# EAGLE design 7segement4digits1badidea-shield-mk-4 (EAGLE 6.5.0)
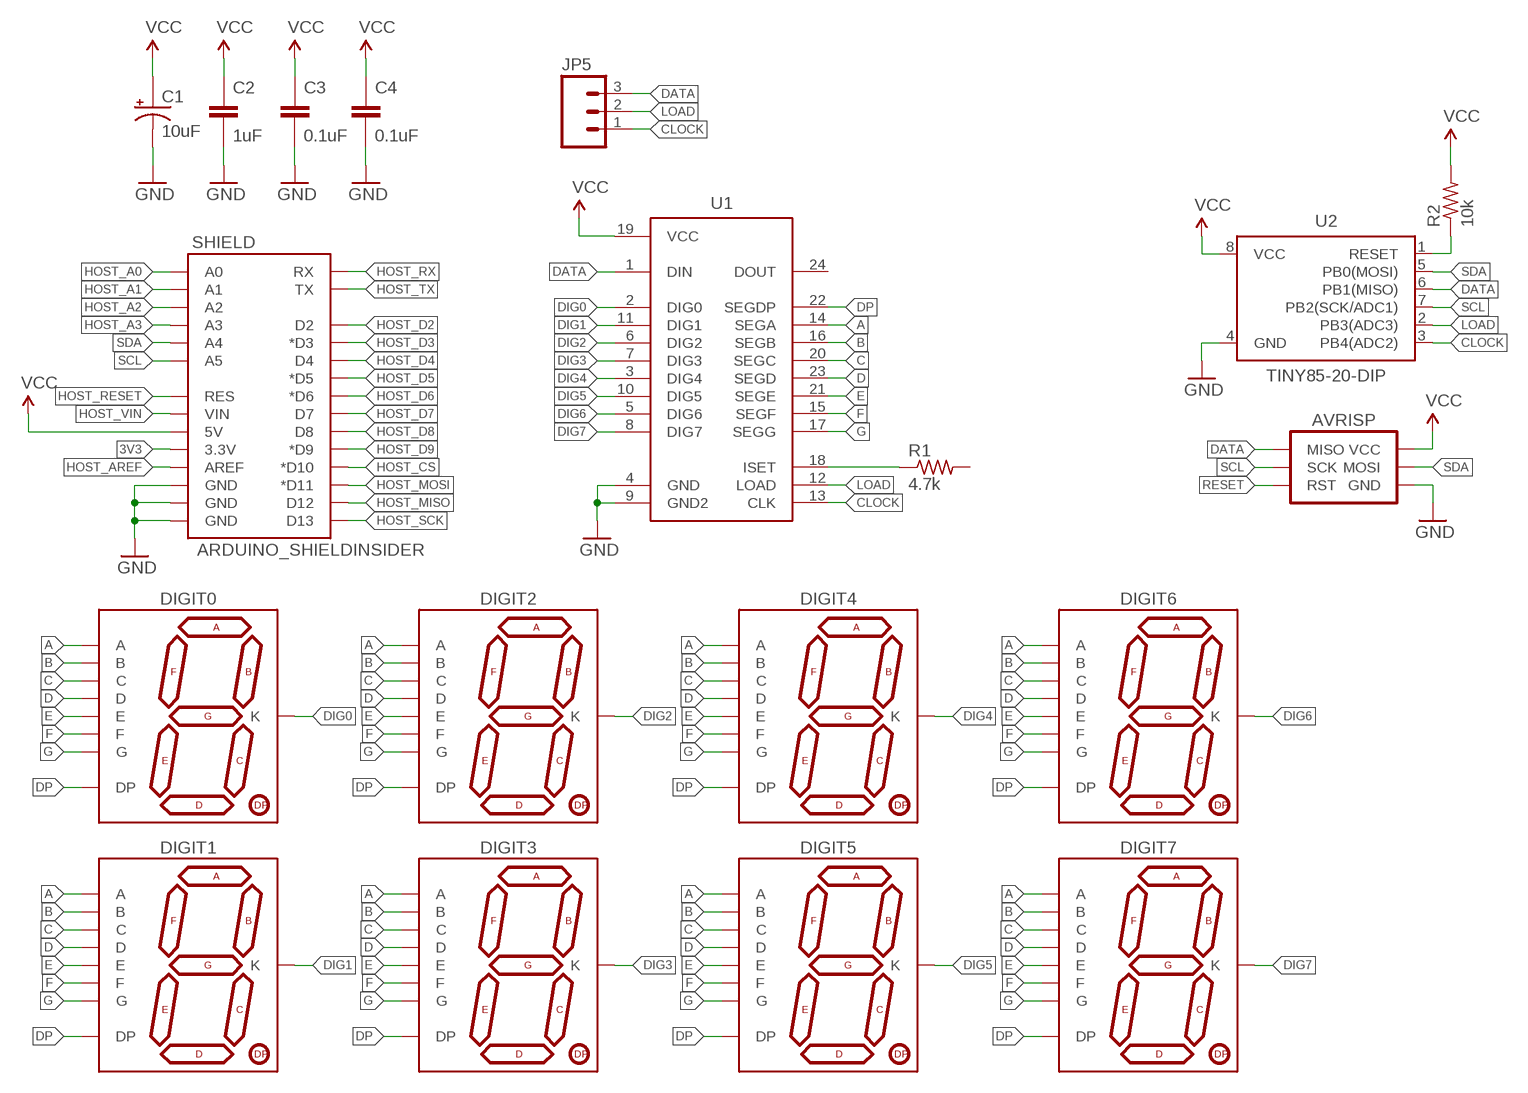
[diagram p0: schematic, sheet 1]

## Parts
AVRISP  AVR_SPI_PRG_6PTH  [2X3]
C1  10uF  CAPACITOR-POLARIZEDE2.5-5  [E2,5-5]
C2  1uF  CAPACITOR-CERAMIC025-024X044  [C025-024X044]
C3  0.1uF  CAPACITOR-CERAMIC025-024X044  [C025-024X044]
C4  0.1uF  CAPACITOR-CERAMIC025-024X044  [C025-024X044]
DIGIT0  7SEG_1DIGPTH-10MM  [7SEG_1DIG_10MM]
DIGIT1  7SEG_1DIGPTH-10MM  [7SEG_1DIG_10MM]
DIGIT2  7SEG_1DIGPTH-10MM  [7SEG_1DIG_10MM]
DIGIT3  7SEG_1DIGPTH-10MM  [7SEG_1DIG_10MM]
DIGIT4  7SEG_1DIGPTH-10MM  [7SEG_1DIG_10MM]
DIGIT5  7SEG_1DIGPTH-10MM  [7SEG_1DIG_10MM]
DIGIT6  7SEG_1DIGPTH-10MM  [7SEG_1DIG_10MM]
DIGIT7  7SEG_1DIGPTH-10MM  [7SEG_1DIG_10MM]
JP5  M03PTH  [1X03]
R1  4.7k  RESISTORPTH-AXIAL-7.68MM  [RESISTOR-AXIAL-PTH-7.68MM]
R2  10k  RESISTORPTH-AXIAL-7.68MM  [RESISTOR-AXIAL-PTH-7.68MM]
SHIELD  ARDUINO_SHIELDINSIDER  [ARDUINO_SHIELD_NOOUTLINE_INSIDE]
U1  MAX7219DIP  [DIL24]
U2  TINY85-20-DIP  ATTINY45TINY85-20-DIP  [DIP08]

## Nets
3V3: SHIELD.3.3V
A: DIGIT0.10(A) DIGIT1.10(A) DIGIT2.10(A) DIGIT3.10(A) DIGIT4.10(A) DIGIT5.10(A) DIGIT6.10(A) DIGIT7.10(A) U1.14(SEGA)
B: DIGIT0.9(B) DIGIT1.9(B) DIGIT2.9(B) DIGIT3.9(B) DIGIT4.9(B) DIGIT5.9(B) DIGIT6.9(B) DIGIT7.9(B) U1.16(SEGB)
C: DIGIT0.8(C) DIGIT1.8(C) DIGIT2.8(C) DIGIT3.8(C) DIGIT4.8(C) DIGIT5.8(C) DIGIT6.8(C) DIGIT7.8(C) U1.20(SEGC)
CLOCK: JP5.1 U1.13(CLK) U2.3(PB4(ADC2))
D: DIGIT0.5(D) DIGIT1.5(D) DIGIT2.5(D) DIGIT3.5(D) DIGIT4.5(D) DIGIT5.5(D) DIGIT6.5(D) DIGIT7.5(D) U1.23(SEGD)
DATA: AVRISP.1(MISO) JP5.3 U1.1(DIN) U2.6(PB1(MISO))
DIG0: DIGIT0.1(K) DIGIT0.6(K) U1.2(DIG0)
DIG1: DIGIT1.1(K) DIGIT1.6(K) U1.11(DIG1)
DIG2: DIGIT2.1(K) DIGIT2.6(K) U1.6(DIG2)
DIG3: DIGIT3.1(K) DIGIT3.6(K) U1.7(DIG3)
DIG4: DIGIT4.1(K) DIGIT4.6(K) U1.3(DIG4)
DIG5: DIGIT5.1(K) DIGIT5.6(K) U1.10(DIG5)
DIG6: DIGIT6.1(K) DIGIT6.6(K) U1.5(DIG6)
DIG7: DIGIT7.1(K) DIGIT7.6(K) U1.8(DIG7)
DP: DIGIT0.7(DP) DIGIT1.7(DP) DIGIT2.7(DP) DIGIT3.7(DP) DIGIT4.7(DP) DIGIT5.7(DP) DIGIT6.7(DP) DIGIT7.7(DP) U1.22(SEGDP)
E: DIGIT0.4(E) DIGIT1.4(E) DIGIT2.4(E) DIGIT3.4(E) DIGIT4.4(E) DIGIT5.4(E) DIGIT6.4(E) DIGIT7.4(E) U1.21(SEGE)
F: DIGIT0.2(F) DIGIT1.2(F) DIGIT2.2(F) DIGIT3.2(F) DIGIT4.2(F) DIGIT5.2(F) DIGIT6.2(F) DIGIT7.2(F) U1.15(SEGF)
G: DIGIT0.3(G) DIGIT1.3(G) DIGIT2.3(G) DIGIT3.3(G) DIGIT4.3(G) DIGIT5.3(G) DIGIT6.3(G) DIGIT7.3(G) U1.17(SEGG)
GND: AVRISP.6(GND) C1.- C2.2 C3.2 C4.2 SHIELD.GND@0(GND) SHIELD.GND@1(GND) SHIELD.GND@2(GND) U1.4(GND) U1.9(GND2) U2.4(GND)
HOST_A0: SHIELD.A0
HOST_A1: SHIELD.A1
HOST_A2: SHIELD.A2
HOST_A3: SHIELD.A3
HOST_AREF: SHIELD.AREF
HOST_CS: SHIELD.D10(*D10)
HOST_D2: SHIELD.D2
HOST_D3: SHIELD.D3(*D3)
HOST_D4: SHIELD.D4
HOST_D5: SHIELD.D5(*D5)
HOST_D6: SHIELD.D6(*D6)
HOST_D7: SHIELD.D7
HOST_D8: SHIELD.D8
HOST_D9: SHIELD.D9(*D9)
HOST_MISO: SHIELD.D12
HOST_MOSI: SHIELD.D11(*D11)
HOST_RESET: SHIELD.RES
HOST_RX: SHIELD.RX
HOST_SCK: SHIELD.D13
HOST_TX: SHIELD.TX
HOST_VIN: SHIELD.VIN
LOAD: JP5.2 U1.12(LOAD) U2.2(PB3(ADC3))
N$1: R2.P$1 U2.1(RESET)
N$19: R1.P$1 U1.18(ISET)
RESET: AVRISP.5(RST)
SCL: AVRISP.3(SCK) SHIELD.A5 U2.7(PB2(SCK/ADC1))
SDA: AVRISP.4(MOSI) SHIELD.A4 U2.5(PB0(MOSI))
VCC: AVRISP.2(VCC) C1.+ C2.1 C3.1 C4.1 R2.P$2 SHIELD.5V U1.19(VCC) U2.8(VCC)
Unconnected: R1.P$2 U1.24(DOUT)

## Library data of the parts
AVRISP = A_butts:AVR_SPI_PRG_6: AVR ISP 6 Pin This is the reduced ISP connector for AVR programming. Common on Arduino. This footprint will take up less PCB space and can be used with a 10-pin to 6-pin adapter such as SKU: BOB-08508 **Special note about "TEST_POINT" package. The stop mask is on the top side, so if you want your programming test points to be on the bottom of your board, make sure to place this package on the bottom side of the board. This also ensure that the orientation to program from the bottom side will be correct.
C1 = A_butts:CAPACITOR-POLARIZED: POLARIZED CAPACITOR, American symbol
C2-C4 = A_butts:CAPACITOR-CERAMIC: CAPACITOR, European symbol
DIGIT0 DIGIT1-DIGIT7 = A_butts:7SEG_1DIG
JP5 = A_butts:M03: Header 3 Standard 3-pin 0.1" header. Use with straight break away headers (SKU : PRT-00116), right angle break away headers (PRT-00553), swiss pins (PRT-00743), machine pins (PRT-00117), and female headers (PRT-00115). Molex polarized connector foot print use with SKU : PRT-08232 with associated crimp pins and housings.
R1 R2 = A_butts:RESISTOR: RESISTOR, American symbol
SHIELD = A_butts:ARDUINO_SHIELD: Arduino shield footprint
U1 = A_butts:MAX7219: 8-digit, 8-segment LED display driver, serial input
U2 = A_butts:ATTINY45: Atmel 8-pin 2/4/8kB flash uC; PROD_ID: IC-09445

## Board
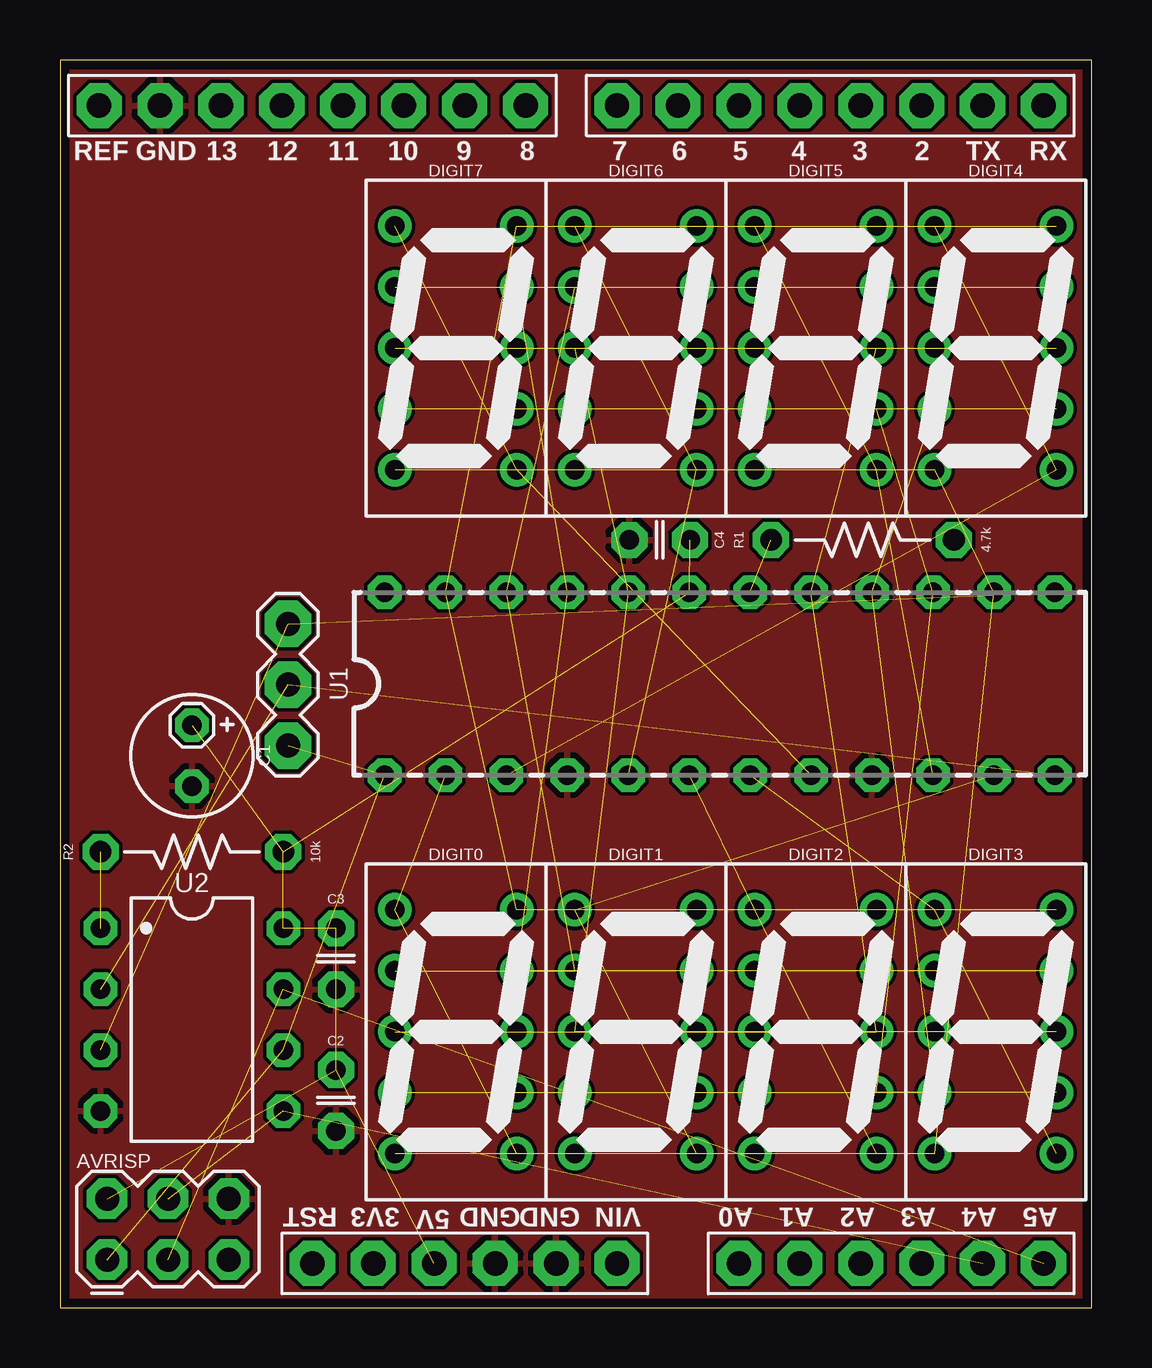
[diagram p1: board, top side]

Size 43 x 52 mm. Coordinates in mm from the lower left corner, seen from the top.
Outline: 0,52 0,0 43,0 43,52 0,52
Copper layers (1*16): Top 0.0356mm / dielectric 1.5011mm / Bottom 0.0356mm
Design rules "LaenPCBOrder_2": minimum track width 6mil, minimum drill 13mil, track to track 6mil, track to pad 6mil, pad to pad 6mil, via to via 6mil, smd to smd 6mil, copper to edge 15mil, drill to drill 6mil, minimum pad ring 7mil, minimum via ring 7mil, stop-mask expansion 3mil, vias tented up to drill 20mil, thermal gap 10mil

### Footprints (pad centres in the part's own frame; a part is rotated, then mirrored left to right if it is on the bottom)
2X3 = drill 1 pad 1.676 octagon: 1 -2.54,-1.27; 2 -2.54,1.27; 3 0,-1.27; 4 0,1.27; 5 2.54,-1.27; 6 2.54,1.27
E2,5-5 = drill 0.8 pad 1.4 octagon: + -1.27,0; - 1.27,0
C025-024X044 = drill 0.813 pad 1.5 octagon: 1 -1.27,0; 2 1.27,0
7SEG_1DIG_10MM = drill 0.8 pad 1.4: 1 -2.54,5.08; 2 -2.54,2.54; 3 -2.54,0; 4 -2.54,-2.54; 5 -2.54,-5.08; 6 2.54,-5.08; 7 2.54,-2.54; 8 2.54,0; 9 2.54,2.54; 10 2.54,5.08
1X03 = drill 1 pad 1.93 octagon: 1 0,0; 2 2.54,0; 3 5.08,0
RESISTOR-AXIAL-PTH-7.68MM = drill 0.9 pad 1.5 octagon: P$1 -3.81,0; P$2 3.81,0
ARDUINO_SHIELD_NOOUTLINE_INSIDE = drill 1.016 pad 1.88 octagon: 3.3V 48.26,-27.94; 5V 48.26,-25.4; A0 48.26,-12.7; A1 48.26,-10.16; A2 48.26,-7.62; A3 48.26,-5.08; A4 48.26,-2.54; A5 48.26,0; AREF 0,-39.37; D2 0,-5.08; D3 0,-7.62; D4 0,-10.16; D5 0,-12.7; D6 0,-15.24; D7 0,-17.78; D8 0,-21.59; D9 0,-24.13; D10 0,-26.67; D11 0,-29.21; D12 0,-31.75; D13 0,-34.29; GND@0 48.26,-22.86; GND@1 48.26,-20.32; GND@2 0,-36.83; RES 48.26,-30.48; RX 0,0; TX 0,-2.54; VIN 48.26,-17.78
DIL24 = drill 0.8 pad 1.4 octagon: 1 -13.97,-3.81; 2 -11.43,-3.81; 3 -8.89,-3.81; 4 -6.35,-3.81; 5 -3.81,-3.81; 6 -1.27,-3.81; 7 1.27,-3.81; 8 3.81,-3.81; 9 6.35,-3.81; 10 8.89,-3.81; 11 11.43,-3.81; 12 13.97,-3.81; 13 13.97,3.81; 14 11.43,3.81; 15 8.89,3.81; 16 6.35,3.81; 17 3.81,3.81; 18 1.27,3.81; 19 -1.27,3.81; 20 -3.81,3.81; 21 -6.35,3.81; 22 -8.89,3.81; 23 -11.43,3.81; 24 -13.97,3.81
DIP08 = drill 0.8 pad 1.4 octagon: 1 -3.81,-3.81; 2 -1.27,-3.81; 3 1.27,-3.81; 4 3.81,-3.81; 5 3.81,3.81; 6 1.27,3.81; 7 -1.27,3.81; 8 -3.81,3.81

### Placement (x,y rotation side)
AVRISP  4.5,3.27 0 top
C1  5.5,23 270 top
C2  11.5,8.63 270 top
C3  11.5,14.54 270 top
C4  25,32 180 top
DIGIT0  16.5,11.5 180 top
DIGIT1  24,11.5 180 top
DIGIT2  31.5,11.5 180 top
DIGIT3  39,11.5 180 top
DIGIT4  39,40 180 top
DIGIT5  31.5,40 180 top
DIGIT6  24,40 180 top
DIGIT7  16.5,40 180 top
JP5  9.5,28.5 270 top
R1  33.45,32 0 top
R2  5.5,19 0 top
SHIELD  41,50.1 270 top
U1  27.5,26 0 top
U2  5.5,12 270 top

### Tracks (layer width: path | path; a pad name or v marks a point on that pad's centre or on a via)
A  (8 unrouted)
B  (8 unrouted)
C  (8 unrouted)
CLOCK  (2 unrouted)
D  (8 unrouted)
DATA  (3 unrouted)
DIG0  (2 unrouted)
DIG1  (2 unrouted)
DIG2  (2 unrouted)
DIG3  (2 unrouted)
DIG4  (2 unrouted)
DIG5  (2 unrouted)
DIG6  (2 unrouted)
DIG7  (2 unrouted)
DP  (8 unrouted)
E  (8 unrouted)
F  (8 unrouted)
G  (8 unrouted)
GND
  pour Top: 0,52 43,52 43,0 0,0
LOAD  (2 unrouted)
N$1  (1 unrouted)
N$19  (1 unrouted)
SCL  (2 unrouted)
SDA  (2 unrouted)
VCC  (8 unrouted)